# Altium schematic sheet ViDieuKhienSTM32F103C8T6.SchDoc
size A
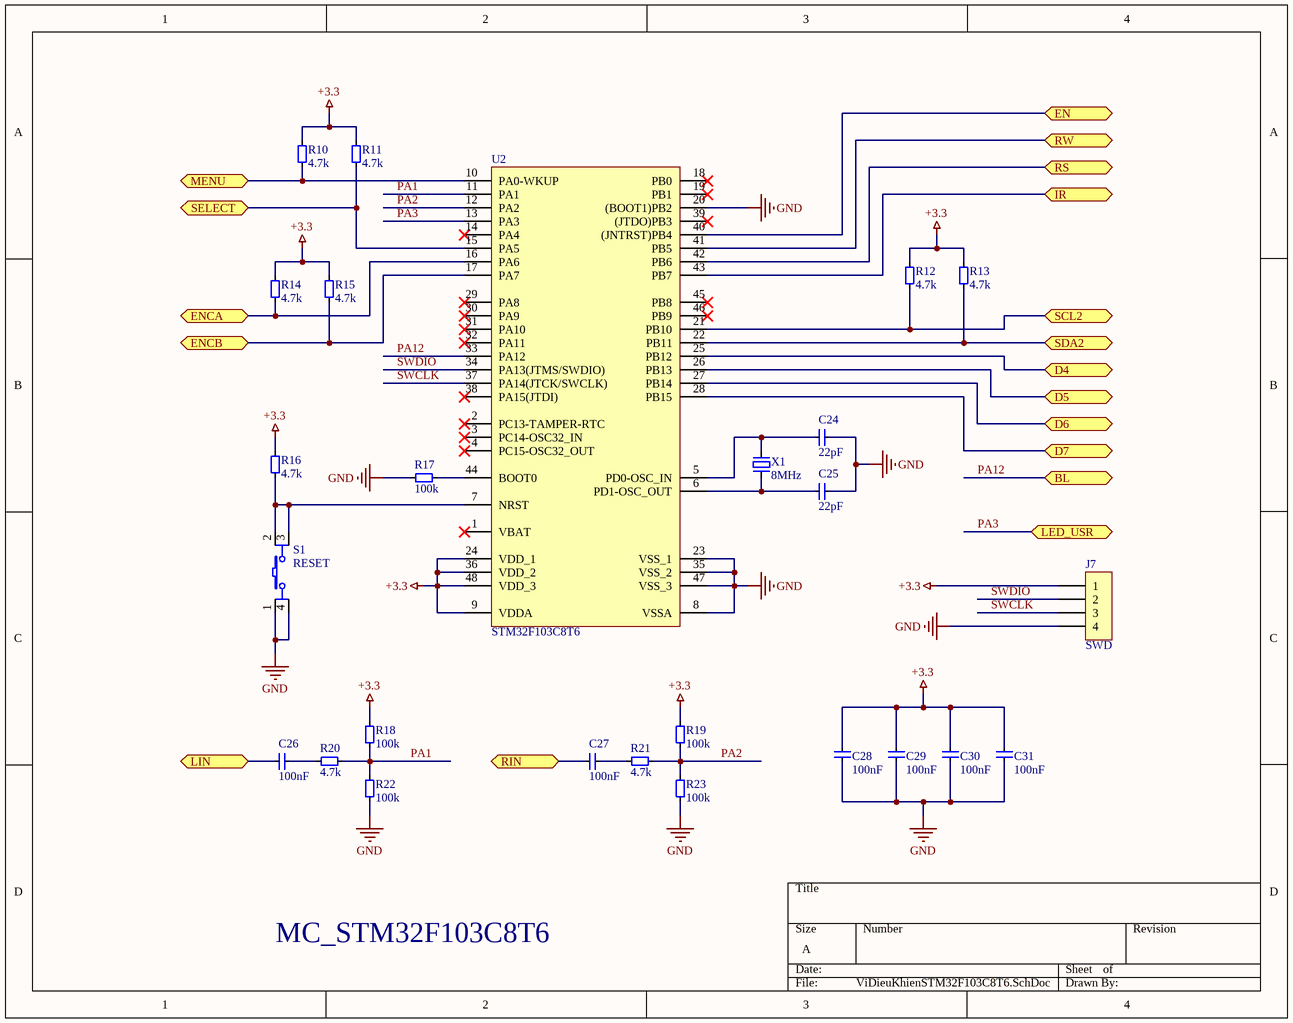
[diagram p0: ViDieuKhienSTM32F103C8T6.SchDoc]

## Parts
C24  22pF  [C-0805]
C25  22pF  [C-0805]
C26  100nF  [C-0805]
C27  100nF  [C-0805]
C28  100nF  [C-0805]
C29  100nF  [C-0805]
C30  100nF  [C-0805]
C31  100nF  [C-0805]
J7  SWD  [JP1X4M-2.54]
R10  4.7k  [R-0805]
R11  4.7k  [R-0805]
R12  4.7k  [R-0805]
R13  4.7k  [R-0805]
R14  4.7k  [R-0805]
R15  4.7k  [R-0805]
R16  4.7k  [R-0805]
R17  100k  [R-0805]
R18  100k  [R-0805]
R19  100k  [R-0805]
R20  4.7k  [R-0805]
R21  4.7k  [R-0805]
R22  100k  [R-0805]
R23  100k  [R-0805]
S1  RESET  [SW4P-DIP-6X6MM]
U2  STM32F103C8T6  [LQFP48-0.5-7X7MM]
X1  8MHz  [XTAL-HC49US]

## Ports
BL (bidir), D4 (bidir), D5 (bidir), D6 (bidir), D7 (bidir), EN (bidir), ENCA (bidir), ENCB (bidir), IR (bidir), LED_USR (bidir), LIN (bidir), MENU (bidir), RIN (bidir), RS (bidir), RW (bidir), SCL2 (bidir), SDA2 (bidir), SELECT (bidir)

## Nets
+3.3: C28.1 C29.1 C30.1 C31.1 J7.1 R10.2 R11.2 R12.2 R13.2 R14.2 R15.2 R16.2 R18.2 R19.2 U2.9(VDDA) U2.24(VDD_1) U2.36(VDD_2) U2.48(VDD_3)
GND: C24.1 C25.1 C28.2 C29.2 C30.2 C31.2 J7.4 R17.1 R22.1 R23.1 S1.1 S1.4 U2.8(VSSA) U2.20((BOOT1)PB2) U2.23(VSS_1) U2.35(VSS_2) U2.47(VSS_3)
D4: U2.25(PB12) ; port D4
D5: U2.26(PB13) ; port D5
D6: U2.27(PB14) ; port D6
D7: U2.28(PB15) ; port D7
EN: U2.40((JNTRST)PB4) ; port EN
ENCA: R14.1 U2.16(PA6) ; port ENCA
ENCB: R15.1 U2.17(PA7) ; port ENCB
IR: U2.43(PB7) ; port IR
LIN: C26.2 ; port LIN
MENU: R10.1 U2.10(PA0-WKUP) ; port MENU
PA1: R18.1 R20.1 R22.2 U2.11(PA1)
PA2: R19.1 R21.1 R23.2 U2.12(PA2)
PA3: U2.13(PA3) ; port LED_USR
PA12: U2.33(PA12) ; port BL
RIN: C27.2 ; port RIN
RS: U2.42(PB6) ; port RS
RW: U2.41(PB5) ; port RW
SCL2: R12.1 U2.21(PB10) ; port SCL2
SDA2: R13.1 U2.22(PB11) ; port SDA2
SELECT: R11.1 U2.15(PA5) ; port SELECT
SWCLK: J7.3 U2.37(PA14(JTCK/SWCLK))
SWDIO: J7.2 U2.34(PA13(JTMS/SWDIO))
NetC24_2: C24.2 U2.5(PD0-OSC_IN) X1.1
NetC25_2: C25.2 U2.6(PD1-OSC_OUT) X1.2
NetC26_1: C26.1 R20.2
NetC27_1: C27.1 R21.2
NetR16_1: R16.1 S1.2 S1.3 U2.7(NRST)
NetR17_2: R17.2 U2.44(BOOT0)

Not connected (* = marked no-connect by the designer): U2 1(VBAT)* 2(PC13-TAMPER-RTC)* 3(PC14-OSC32_IN)* 4(PC15-OSC32_OUT)* 14(PA4)* 18(PB0)* 19(PB1)* 29(PA8)* 30(PA9)* 31(PA10)* 32(PA11)* 38(PA15(JTDI))* 39((JTDO)PB3)* 45(PB8)* 46(PB9)*

## Notes on the sheet
- MC_STM32F103C8T6

## Library data of the parts
C24-C31 = CAP: Cac Loai Tu Khong Phan Cuc
J7 = JP1X4-2.54: Jump Don 4 Chan 2.54mm
R10-R23 = RES: Cac Loai Dien Tro
S1 = SW4P-DIP-6X6MM: Nut Nhan 4 Chan 6X6MM
U2 = STM32F103C8T6: VDK 32-Bit ARM Cortex-M3
X1 = XTAL-HC49: Thach Anh 2 Chan HC49